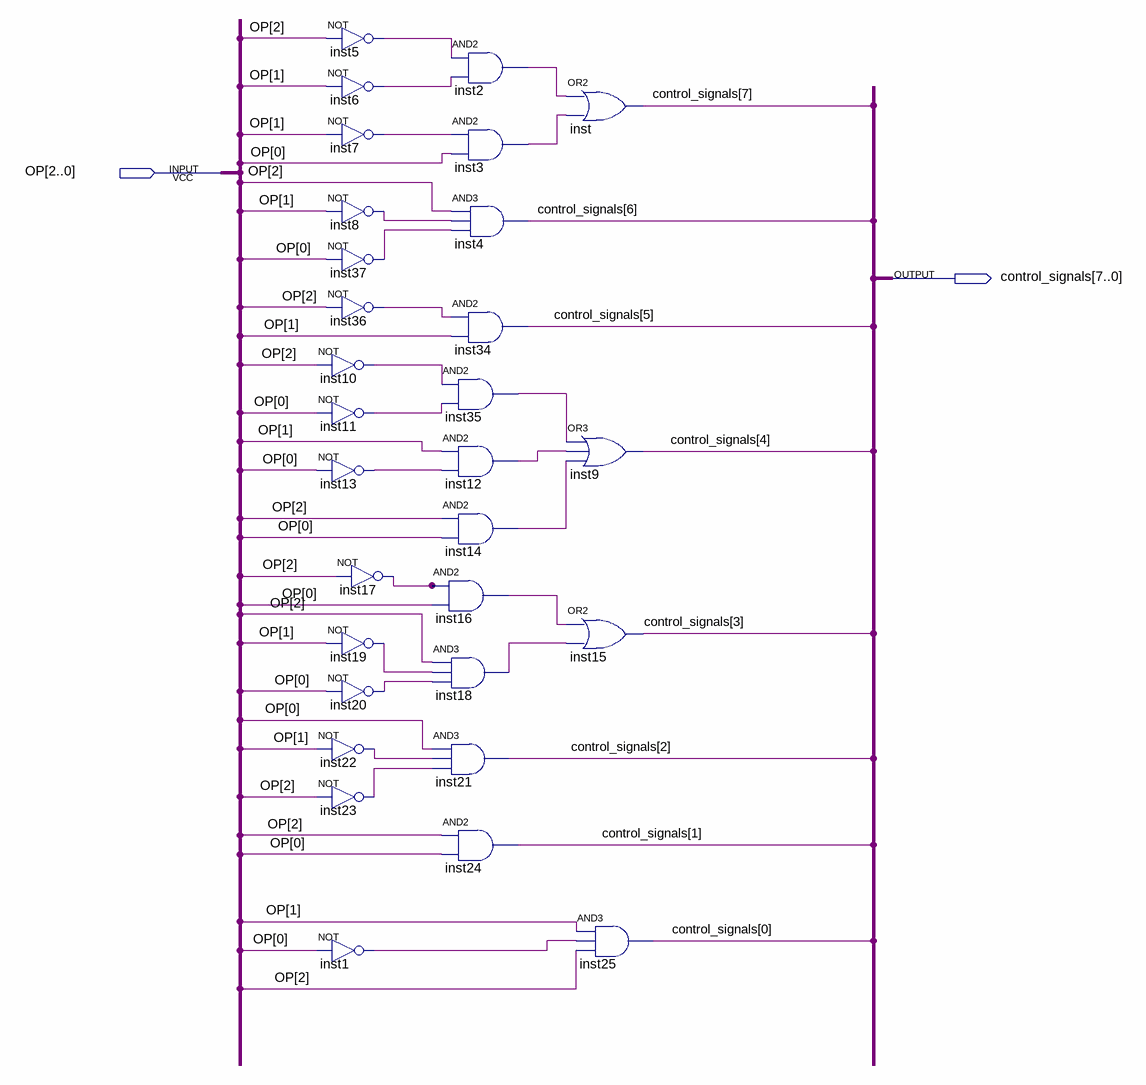
[diagram p0: schematic sheet]
// Quartus schematic control_unit_version1_nojalr.bdf as structural Verilog: 30 symbols, 2 pins
module control_unit_version1_nojalr (
  input  [2:0] OP,
  output [7:0] control_signals
);

  wire inst1_out, inst2_out, inst3_out, inst5_out, inst6_out, inst7_out, inst8_out, inst10_out, inst11_out,
       inst12_out, inst13_out, inst14_out, inst16_out, inst17_out, inst18_out, inst19_out, inst20_out,
       inst22_out, inst23_out, inst35_out, inst36_out, inst37_out;

  not inst5 (inst5_out, OP[2]);
  not inst6 (inst6_out, OP[1]);
  not inst7 (inst7_out, OP[1]);
  not inst8 (inst8_out, OP[1]);
  not inst37 (inst37_out, OP[0]);
  not inst36 (inst36_out, OP[2]);
  not inst10 (inst10_out, OP[2]);
  not inst11 (inst11_out, OP[0]);
  not inst13 (inst13_out, OP[0]);
  not inst17 (inst17_out, OP[2]);
  not inst19 (inst19_out, OP[1]);
  not inst20 (inst20_out, OP[0]);
  not inst22 (inst22_out, OP[1]);
  not inst23 (inst23_out, OP[2]);
  not inst1 (inst1_out, OP[0]);
  and inst35 (inst35_out, inst10_out, inst11_out);
  and inst12 (inst12_out, OP[1], inst13_out);
  and inst14 (inst14_out, OP[2], OP[0]);
  and inst16 (inst16_out, inst17_out, OP[0]);
  and inst18 (inst18_out, OP[2], inst19_out, inst20_out);
  and inst21 (control_signals[2], OP[0], inst22_out, inst23_out);
  and inst24 (control_signals[1], OP[2], OP[0]);
  and inst2 (inst2_out, inst5_out, inst6_out);
  and inst3 (inst3_out, inst7_out, OP[0]);
  and inst4 (control_signals[6], OP[2], inst8_out, inst37_out);
  and inst34 (control_signals[5], inst36_out, OP[1]);
  or inst (control_signals[7], inst2_out, inst3_out);
  or inst9 (control_signals[4], inst35_out, inst12_out, inst14_out);
  or inst15 (control_signals[3], inst16_out, inst18_out);
  and inst25 (control_signals[0], OP[1], inst1_out, OP[2]);
endmodule
